# EAGLE schematic flight_computer (EAGLE 9.6.2)
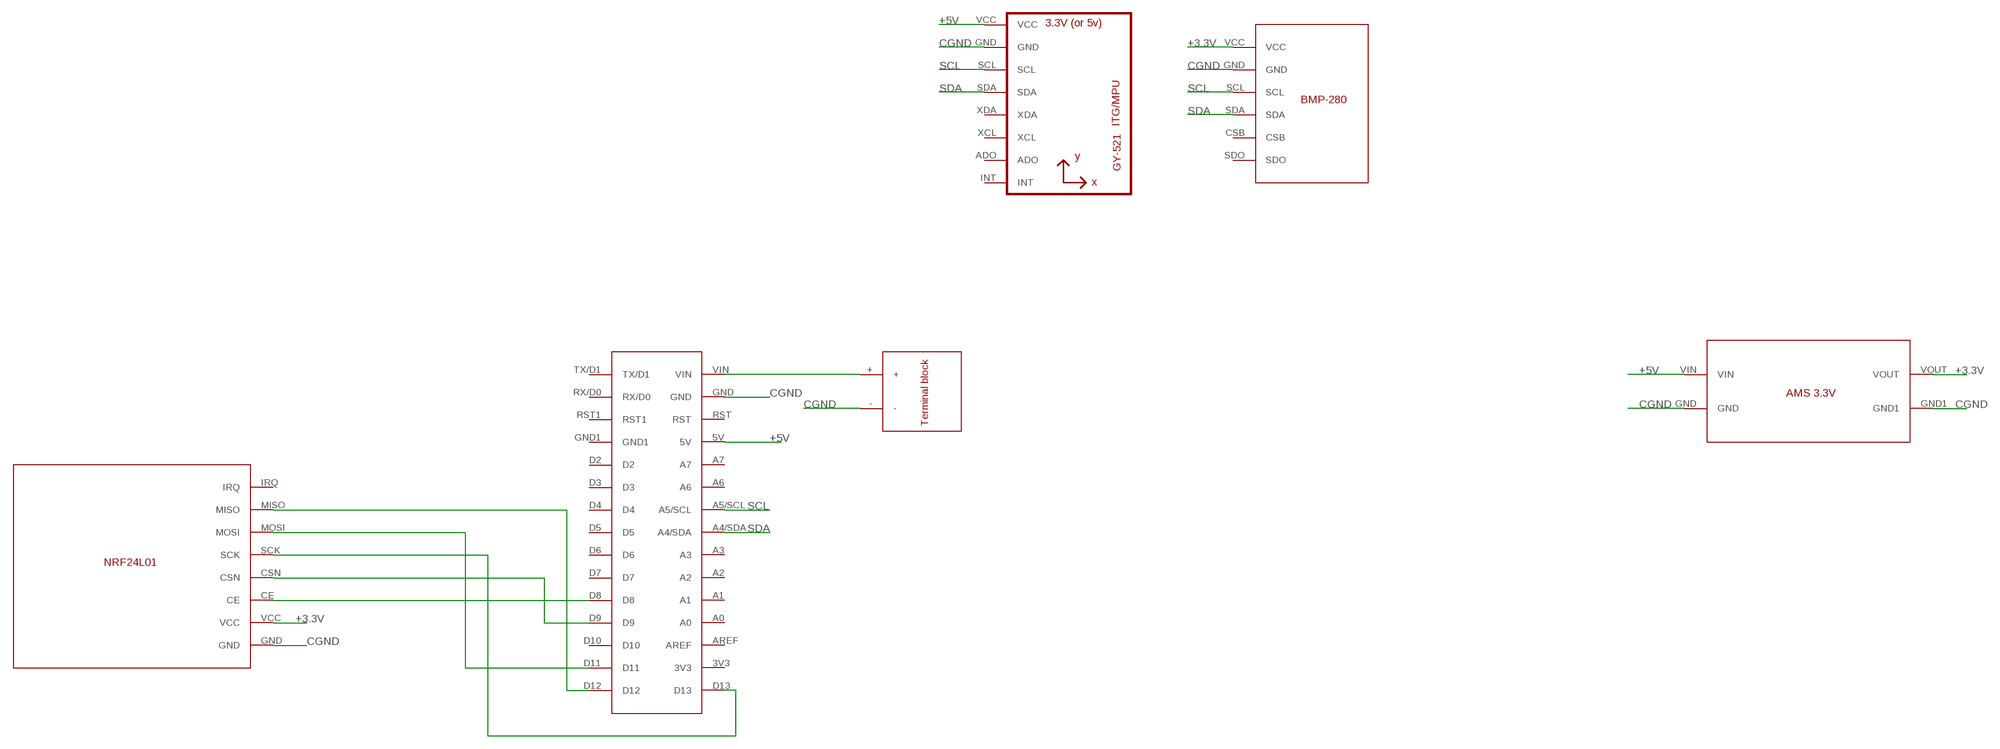
[diagram p0: schematic, sheet 1]

## Parts
U1  GY-521MPU6050  [GY-521]
U$1  ARDUINONANO  [ARDUINONANO]
U$2  3.3V_REGULATOR  [3.3V_REGULATOR]
U$3  NRF24L01  [NRF24L01]
U$4  BMP280  [BMP280]
U$5  TERMINAL_BLOCK  [TERMINAL_BLOCK]

## Nets
+3.3V: U$2.VOUT U$3.VCC U$4.VCC
+5V: U1.VCC U$1.5V U$2.VIN
CGND: U1.GND U$1.GND U$2.GND U$2.GND1 U$3.GND U$4.GND U$5.-
N$1: U$1.VIN U$5.+
N$2: U$1.D8 U$3.CE
N$3: U$1.D9 U$3.CSN
N$4: U$1.D13 U$3.SCK
N$5: U$1.D11 U$3.MOSI
N$6: U$1.D12 U$3.MISO
SCL: U1.SCL U$1.A5/SCL U$4.SCL
SDA: U1.SDA U$1.A4/SDA U$4.SDA
Unconnected: U1.ADO U1.INT U1.XCL U1.XDA U$1.3V3 U$1.A0 U$1.A1 U$1.A2 U$1.A3 U$1.A6 U$1.A7 U$1.AREF U$1.D2 U$1.D3 U$1.D4 U$1.D5 U$1.D6 U$1.D7 U$1.D10 U$1.GND1 U$1.RST U$1.RST1 U$1.RX/D0 U$1.TX/D1 U$3.IRQ U$4.CSB U$4.SDO

## Library data of the parts
U1 = gy-521:GY-521
U$1 = ArduinoNano:ARDUINONANO
U$2 = 3.3V_REGULATOR:3.3V_REGULATOR
U$3 = NRF24L01:NRF24L01
U$4 = BMP280:BMP280
U$5 = TERMINAL_BLOCK:TERMINAL_BLOCK